# Altium schematic sheet LowPassFilter.SchDoc
size A; SheetNumber: 4; SheetTotal: 5
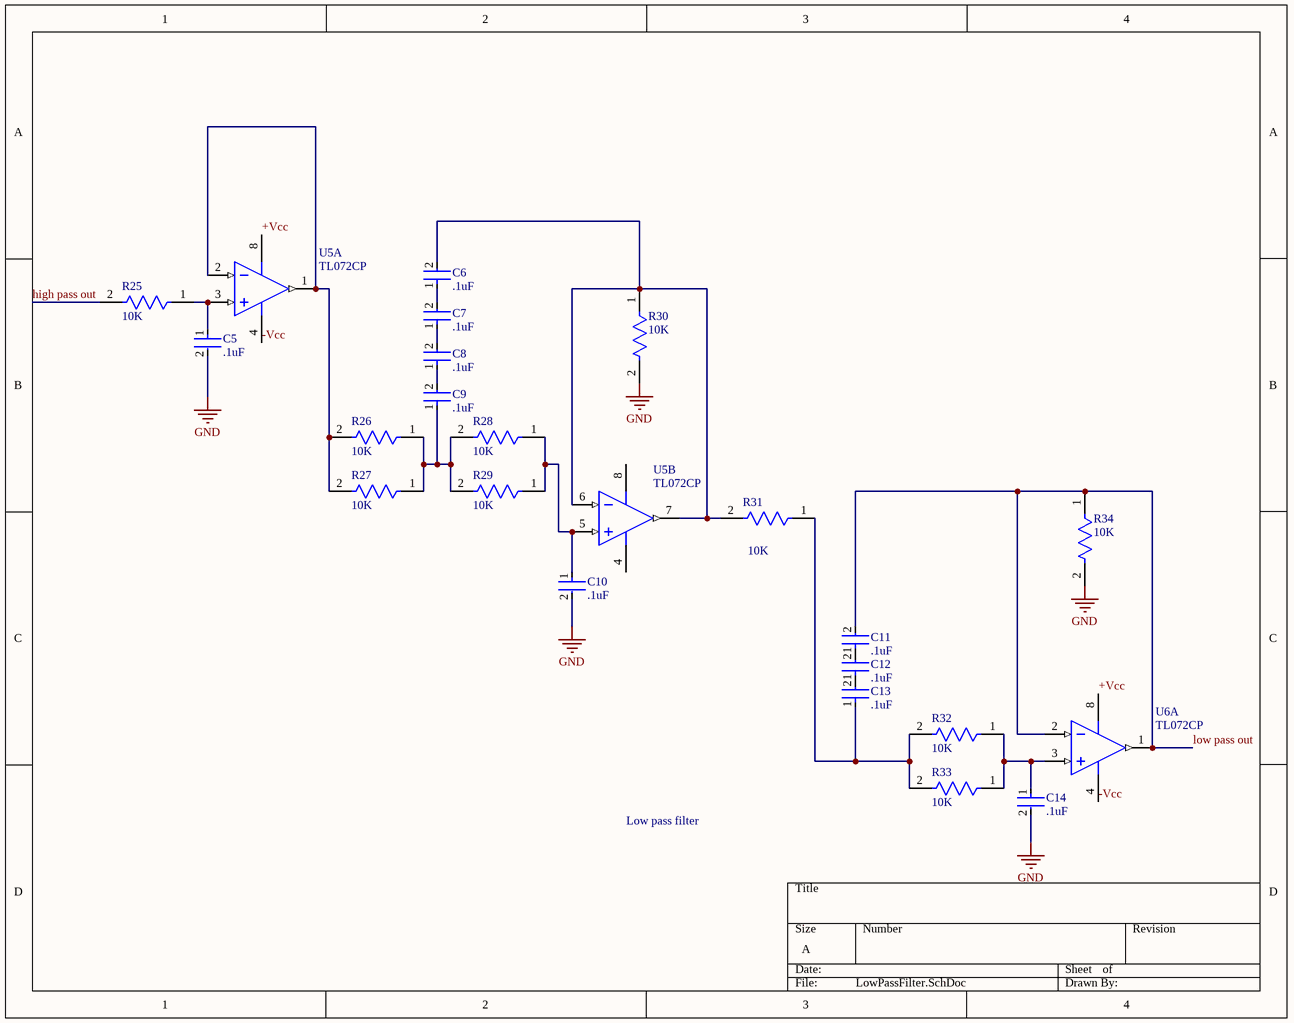
[diagram p0: LowPassFilter.SchDoc]

## Parts
C5  .1uF  [FP-K15H5-MFG]
C6  .1uF  [FP-K15H5-MFG]
C7  .1uF  [FP-K15H5-MFG]
C8  .1uF  [FP-K15H5-MFG]
C9  .1uF  [FP-K15H5-MFG]
C10  .1uF  [FP-K15H5-MFG]
C11  .1uF  [FP-K15H5-MFG]
C12  .1uF  [FP-K15H5-MFG]
C13  .1uF  [FP-K15H5-MFG]
C14  .1uF  [FP-K15H5-MFG]
R25  10K  [FP-CFR-25-MFG]
R26  10K  [FP-CFR-25-MFG]
R27  10K  [FP-CFR-25-MFG]
R28  10K  [FP-CFR-25-MFG]
R29  10K  [FP-CFR-25-MFG]
R30  10K  [FP-CFR-25-MFG]
R31  10K  [FP-CFR-25-MFG]
R32  10K  [FP-CFR-25-MFG]
R33  10K  [FP-CFR-25-MFG]
R34  10K  [FP-CFR-25-MFG]
U5  TL072CP  [P0008A]  (parts A,B of 2)
U6  TL072CP  [P0008A]  (part A of 2)

## Nets
GND: C5.2 C10.2 C14.2 R30.2 R34.2
+Vcc: U5.8(VCC+) U6.8(VCC+)
-Vcc: U5.4(VCC-) U6.4(VCC-)
high pass out: R25.2
low pass out: C11.2 R34.1 U6.1(OUT1) U6.2(IN1-)
NetC5_1: C5.1 R25.1 U5.3(IN1+)
NetC6_1: C6.1 C7.2
NetC6_2: C6.2 R30.1 R31.2 U5.6(IN2-) U5.7(OUT2)
NetC7_1: C7.1 C8.2
NetC8_1: C8.1 C9.2
NetC9_1: C9.1 R26.1 R27.1 R28.2 R29.2
NetC10_1: C10.1 R28.1 R29.1 U5.5(IN2+)
NetC11_1: C11.1 C12.2
NetC12_1: C12.1 C13.2
NetC13_1: C13.1 R31.1 R32.2 R33.2
NetC14_1: C14.1 R32.1 R33.1 U6.3(IN1+)
NetR26_2: R26.2 R27.2 U5.1(OUT1) U5.2(IN1-)

## Notes on the sheet
- Low pass filter

## Library data of the parts
C5-C14 = CMP-02417-000048-1: CAP CER 0.1UF 50V X7R RADIAL; Capacitance: 100nF; Tolerance: 10%; Lead/Base Style: Formed Leads; Lead Length: 30mm; Lead Diameter: 0.5mm; Radiation Hardening: No; Lead Pitch: 5mm; Voltage: 50V; Mount: Through Hole; Package Quantity: 5000; Series: K; Case/Package: Dipped; Min Operating Temperature: -55°C; Depth: 2.5mm; Height - Seated (Max): 0.1inch; Voltage Rating (DC): 50V; Packaging: Bulk; RoHS Compliant: Yes; Construction: RADIAL; Thickness: 2.6mm; Max Operating Temperature: 125°C; Voltage Rating: 50V; Diameter: 500um; Dielectric: X7R; Width: 2.5mm; Length: 4mm; Weight: 0.005644oz; Termination: Radial; Height: 4mm
R25-R34 = CMP-03413-000009-1: RES 10 OHM 1/4W 5% AXIAL; Resistance: 10R; Temperature Coefficient: 500ppm/°C; Max Power Dissipation: 250mW; RoHS Compliant: Yes; Packaging: Bulk; Series: Carbon Film; Case/Package: Axial; Max Operating Temperature: 155°C; Min Operating Temperature: -55°C; Number of Terminations: 2; Length: 0.248inch; Resistor Type: Carbon Film; Tolerance: 5%; Package Quantity: 200
U5 U6 = CMP-0017-00950-2: Dual Low-Noise JFET-Input General-Purpose Operational Amplifier, 7 to 36 V, 0 to 70 degC, 8-pin DIP (P8), Pb-Free (RoHS); Manufacturer: Texas Instruments; Sub Family: General Purpose Amplifier, High Supply Voltage Amplifier (>=30V); Total Supply Voltage(Max)(+5V is 5, +/-5V is 10): 36; Slew Rate(Typ)(V/us): 13; Vn at 1kHz(Typ)(nV/rtHz): 18; GBW(Typ)(MHz): 3; CMRR(Min)(dB): 70; Total Supply Voltage(Min)(+5V is 5, +/-5V is 10): 7; Vio (25C)(Max)(mV): 10; Rating: Catalog; IIB(Max)(pA): 200; Iq per channel(Max)(mA): 2.5; Number of Channels: 2; Mounting Technology: Through Hole; ComponentLink3Description: Package Specification; PartNumber: TL072CP; PackageVersion: 4040082/E, 04/2010; Eco-Plan: Pb-Free (RoHS); DatasheetVersion: SLOS080J; Offset Drift(Typ)(uV/C): 18; ComponentLink3URL: http://www.ti.com/litv/pdf/mpdi001b; PackageDescription: 8-Pin Plastic In-Line, Body 9.59 x 6.35 mm, Pitch 2.54 mm; Code_JEDEC: MS-001; ComponentLink2URL: http://www.ti.com/lit/ds/symlink/tl072.pdf; ComponentLink1Description: Manufacturer URL; ComponentLink2Description: Datasheet; ComponentLink1URL: http://www.ti.com/; PackageReference: P0008A